# EAGLE design 14A-006 (EAGLE 9.6.2)
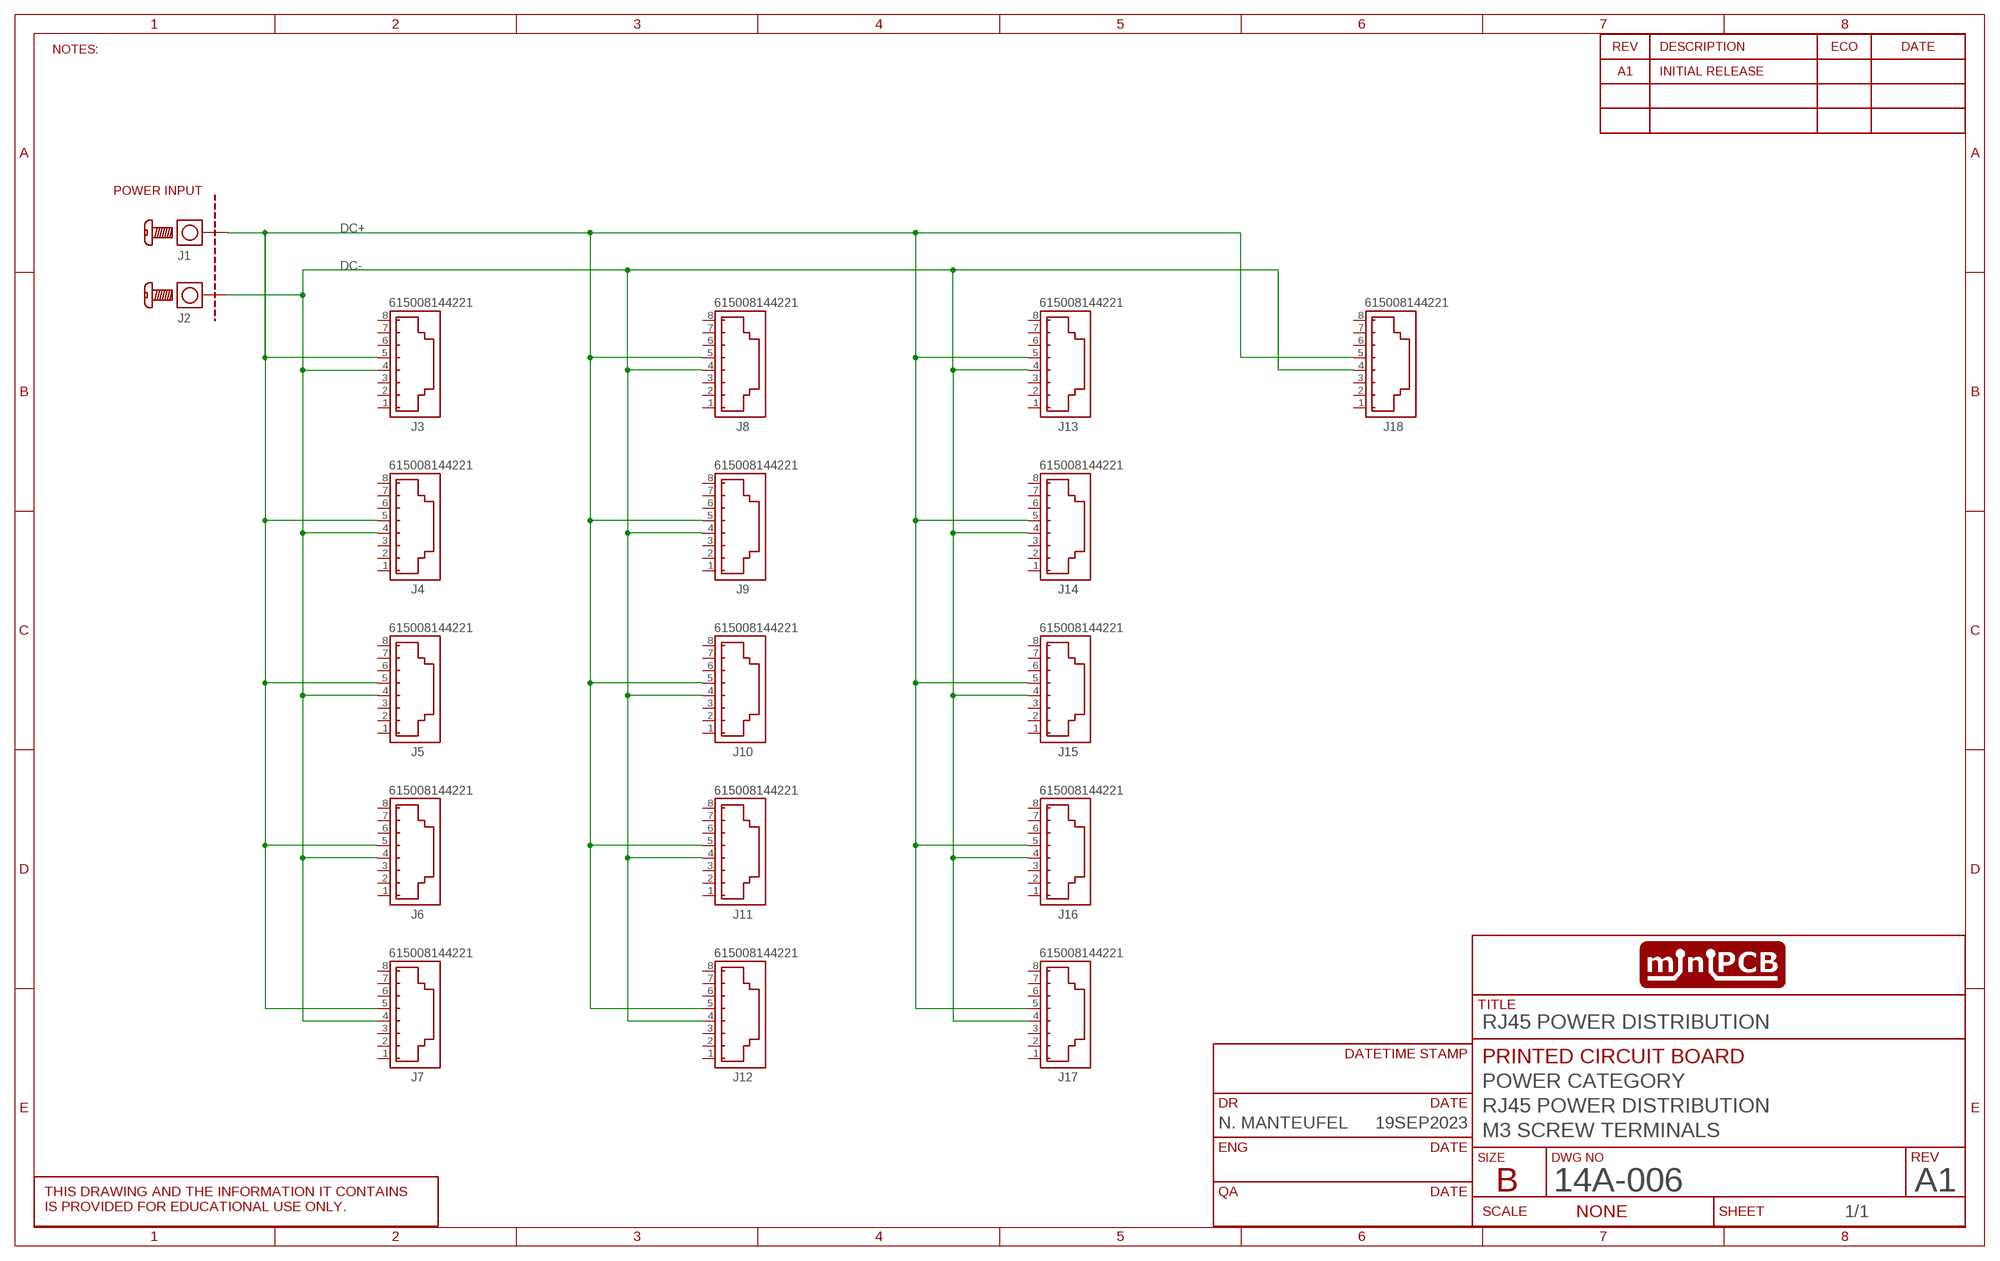
[diagram p0: schematic, sheet 1]
SHEET1 (SCHEMATIC): CIRCUIT_CATEGORY: POWER CATEGORY; CIRCUIT_NAME: RJ45 POWER DISTRIBUTION; CIRCUIT_VARIANT: M3 SCREW TERMINALS; DR: N. MANTEUFEL; DR_DATE: 19SEP2023; PCB_PCBA: PRINTED CIRCUIT BOARD; REVA: A1; REVISION: A1; TITLE: RJ45 POWER DISTRIBUTION

## Parts
-  POWER INPUT  MINIPCB_0PDOCK_50X100  [MINIPCB_DOCK_50X100]
J1  SCREW-TERMINAL  [SCREW-TERMINAL-M3]
J2  SCREW-TERMINAL  [SCREW-TERMINAL-M3]
J3  615008144221  [615008144221]
J4  615008144221  [615008144221]
J5  615008144221  [615008144221]
J6  615008144221  [615008144221]
J7  615008144221  [615008144221]
J8  615008144221  [615008144221]
J9  615008144221  [615008144221]
J10  615008144221  [615008144221]
J11  615008144221  [615008144221]
J12  615008144221  [615008144221]
J13  615008144221  [615008144221]
J14  615008144221  [615008144221]
J15  615008144221  [615008144221]
J16  615008144221  [615008144221]
J17  615008144221  [615008144221]
J18  615008144221  [615008144221]

## Nets
DC+: J1.1 J1.2 J1.3 J1.4 J3.5 J4.5 J5.5 J6.5 J7.5 J8.5 J9.5 J10.5 J11.5 J12.5 J13.5 J14.5 J15.5 J16.5 J17.5 J18.5
DC-: J2.1 J2.2 J2.3 J2.4 J3.4 J4.4 J5.4 J6.4 J7.4 J8.4 J9.4 J10.4 J11.4 J12.4 J13.4 J14.4 J15.4 J16.4 J17.4 J18.4
Unconnected: J3.1 J3.2 J3.3 J3.6 J3.7 J3.8 J4.1 J4.2 J4.3 J4.6 J4.7 J4.8 J5.1 J5.2 J5.3 J5.6 J5.7 J5.8 J6.1 J6.2 J6.3 J6.6 J6.7 J6.8 J7.1 J7.2 J7.3 J7.6 J7.7 J7.8 J8.1 J8.2 J8.3 J8.6 J8.7 J8.8 J9.1 J9.2 J9.3 J9.6 J9.7 J9.8 J10.1 J10.2 J10.3 J10.6 J10.7 J10.8 J11.1 J11.2 J11.3 J11.6 J11.7 J11.8 J12.1 J12.2 J12.3 J12.6 J12.7 J12.8 J13.1 J13.2 J13.3 J13.6 J13.7 J13.8 J14.1 J14.2 J14.3 J14.6 J14.7 J14.8 J15.1 J15.2 J15.3 J15.6 J15.7 J15.8 J16.1 J16.2 J16.3 J16.6 J16.7 J16.8 J17.1 J17.2 J17.3 J17.6 J17.7 J17.8 J18.1 J18.2 J18.3 J18.6 J18.7 J18.8

## Notes on the sheet
- NOTES:

## Library data of the parts
- = minipcb:MINIPCB_0P; NAME1: RJ45 POWER DISTRIBUTION; PART_NUMBER: 14A-006; REVISION: A1
J1 J2 = minipcb:SCREW-TERMINAL; REVISION: A1
J3-J18 = SIG_CONNECTORS:615008144221: WR-MJ Modular Jack Vertical Plastic 8P8C w. Ears Kind Properties Quality Class:500 Mating cycles General Information Operating Temperature:-40 up to +85 °C Compliance:RoHS Electrical Properties IR 1:1.5 A Working Voltage:120V (AC) Withstanding Voltage:1000V (AC) Contact Resistance:20mΩ RISO:500 MΩ Material Properties Insulator MateriaL:PBT Insulator Flammability Rating:UL94 V-0 Color:Black Contact Material Copper Alloy Contact Plating: Gold Contact Type:Stamped Packaging Properties Packaging:Tray <https://www.we-online.com/catalog/media/o33134v209%20Family_WR-MJ_615008144221.jpg> Details see: https://www.we-online.com/catalog/en/MJ_VERTICAL_PLASTIC_8P8C_W_EARS/ Updated by Ella Wu 2020-06-30 2020(C) Würth Elektronik; DATASHEET-URL: https://www.we-online.com/redexpert/spec/615008144221?ae; MFG1: WURTH ELEKTRONIK; MFG1_PN: 61500814221; MOUNT: THT; PART-NUMBER: 615008144221; TYPE: Vertical; XPXC: 8P8C

## Board
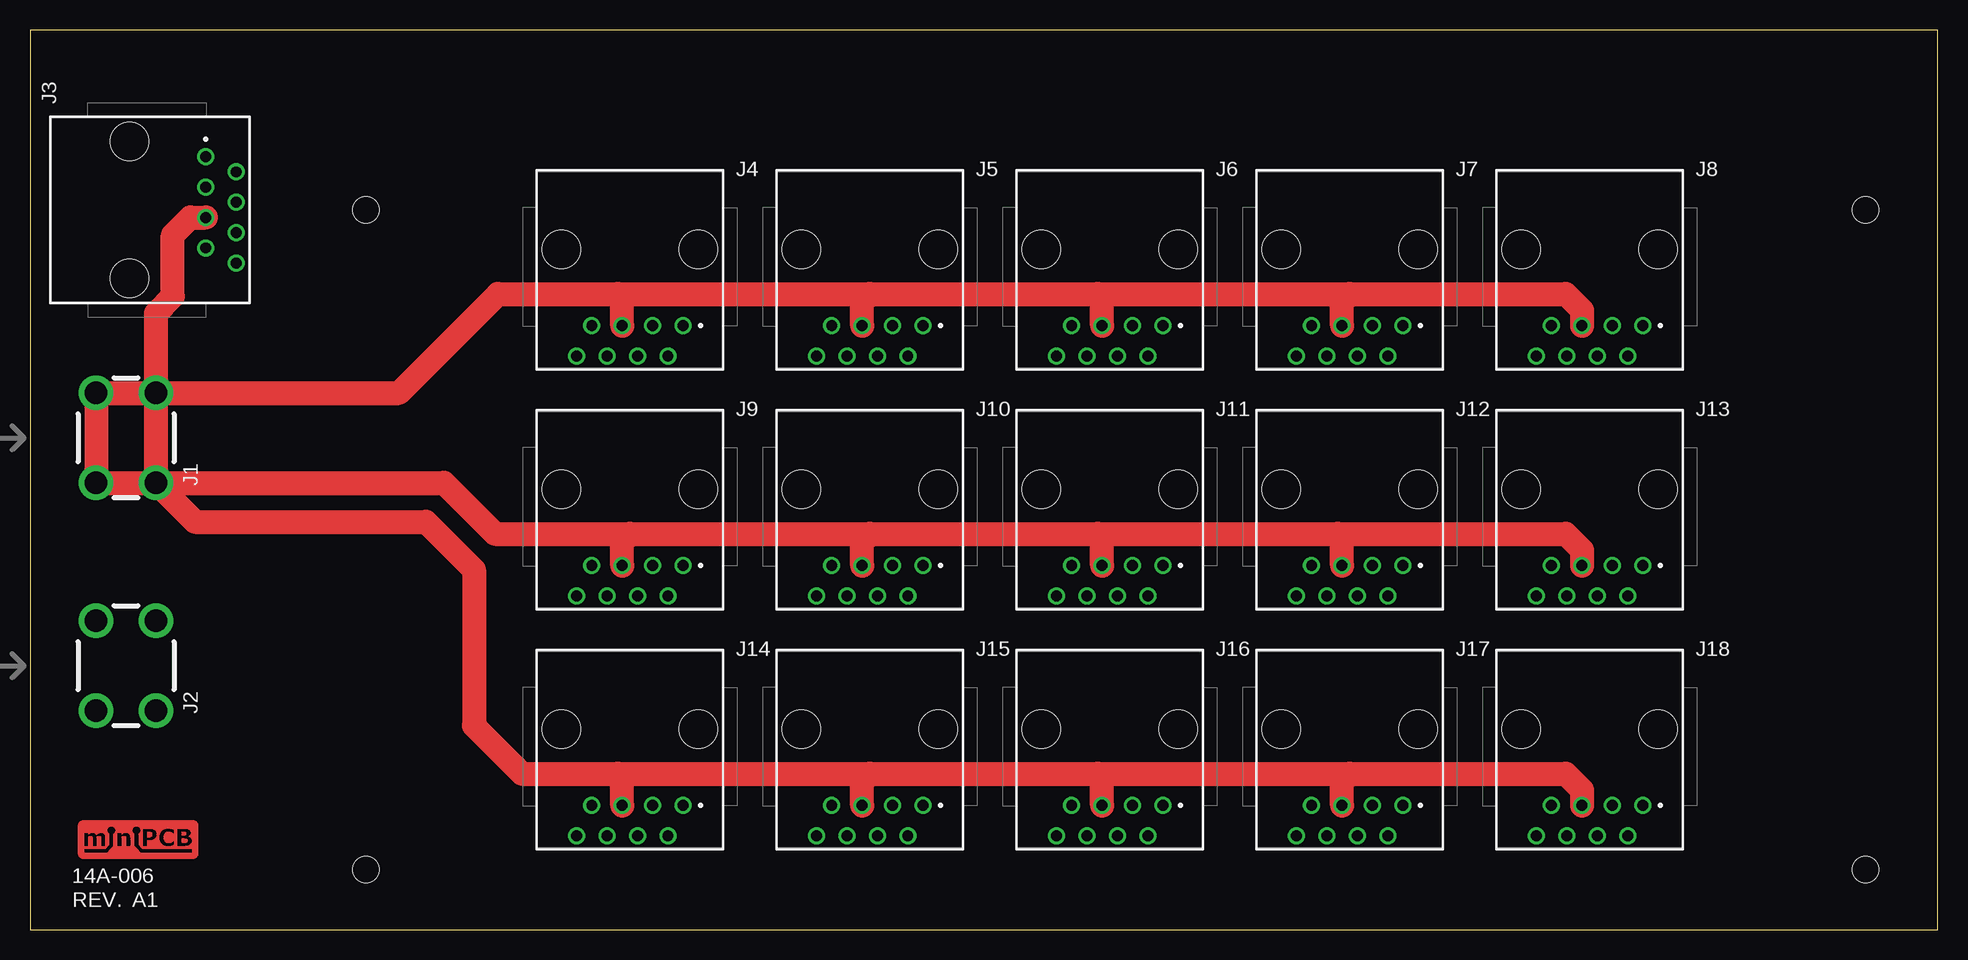
[diagram p1: board, top side]
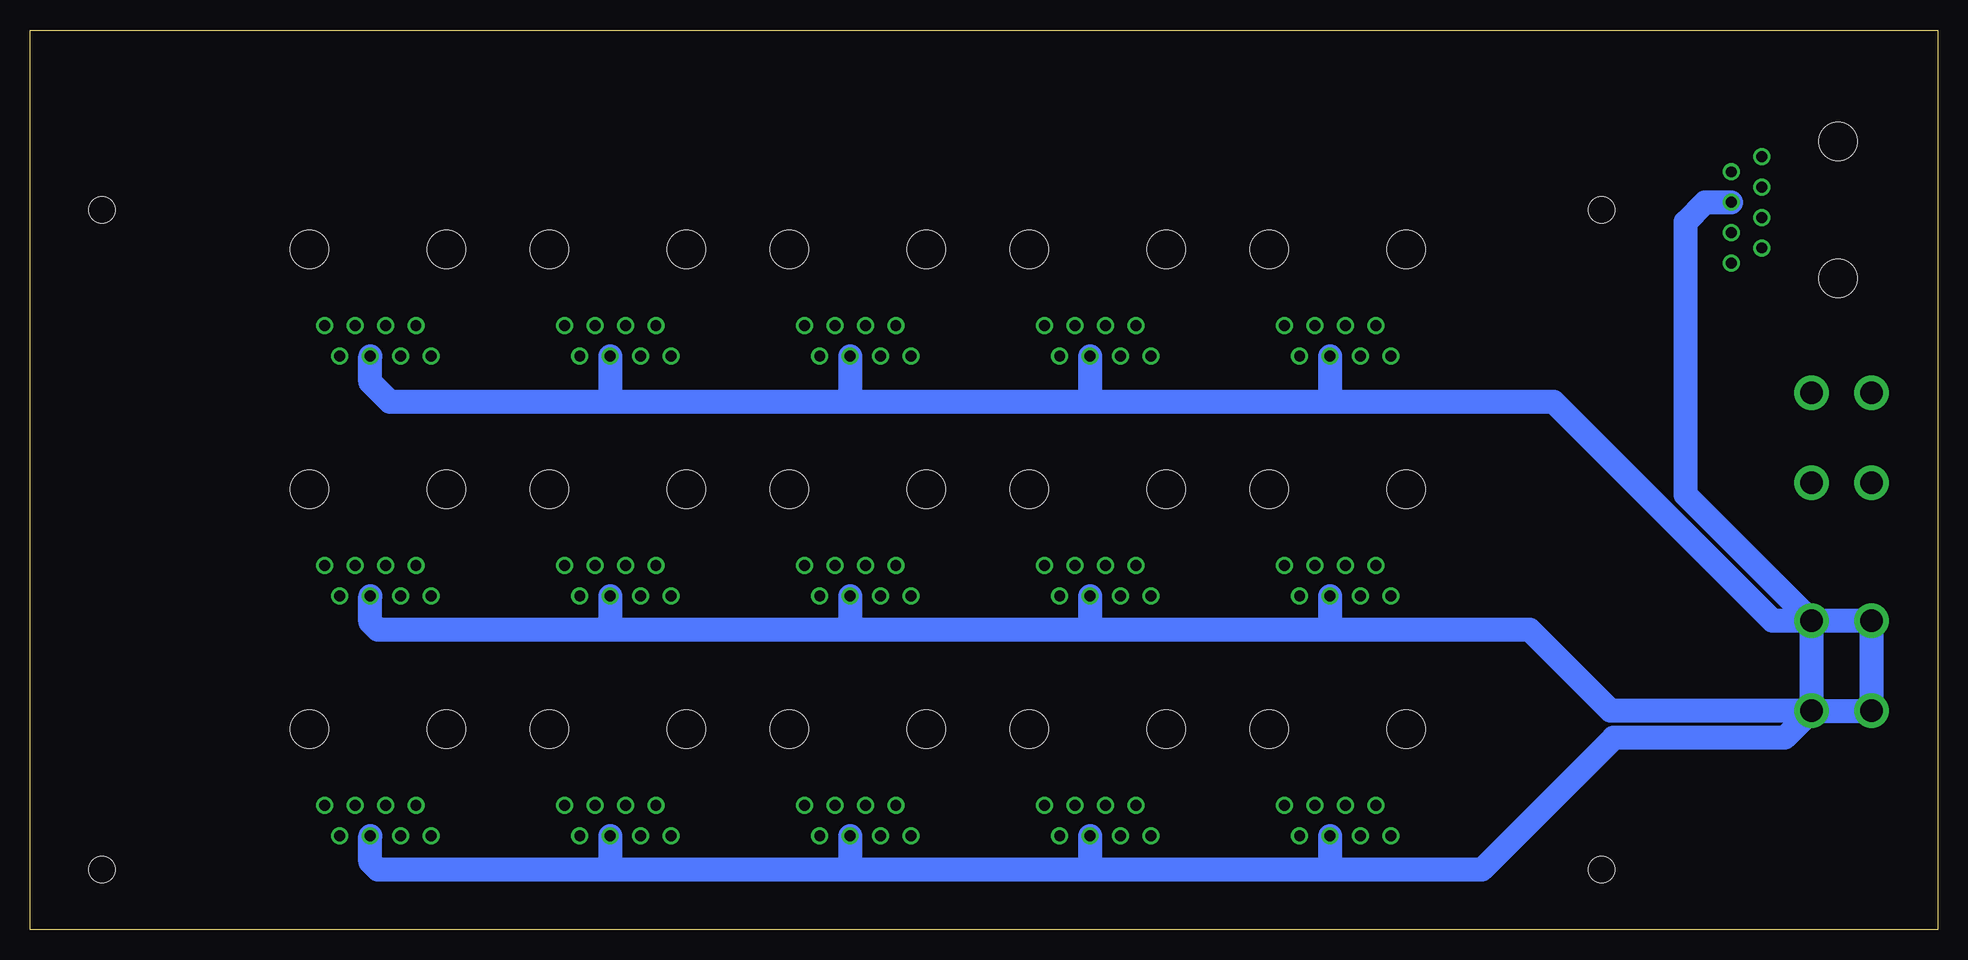
[diagram p2: board, bottom side, seen from below]

Size 159 x 75 mm. Coordinates in mm from the lower left corner, seen from the top.
Outline: 0,0 159,0 159,75 0,75 0,0
Copper layers (1*16): Top 0.035mm / dielectric 1.5mm / Bottom 0.035mm
Design rules "default": minimum track width 6mil, minimum drill 0.35mm, track to track 6mil, track to pad 6mil, pad to pad 6mil, via to via 6mil, smd to smd 6mil, copper to edge 40mil, drill to drill 6mil, minimum pad ring 10mil, minimum via ring 8mil, stop-mask expansion 4mil, vias tented up to drill 0mil, thermal gap 10mil

### Footprints (pad centres in the part's own frame; a part is rotated, then mirrored left to right if it is on the bottom)
MINIPCB_DOCK_50X100 = hole 2.2: 28,5; 153,5; 28,60; 153,60
SCREW-TERMINAL-M3 = drill 1.9: 1 -2.5,3.75; 2 2.5,3.75; 3 -2.5,-3.75; 4 2.5,-3.75
615008144221 = drill 0.9: 1 4.445,-4.65; 2 3.175,-7.19; 3 1.905,-4.65; 4 0.635,-7.19; 5 -0.635,-4.65; 6 -1.905,-7.19; 7 -3.175,-4.65; 8 -4.445,-7.19 | hole 3.17: 5.715,1.7; -5.715,1.7

### Placement (x,y rotation side)
-  0,0 0 top
J1  8,41 0 top
J2  8,22 0 top
J3  10,60 90 top
J4  50,55 0 top
J5  70,55 0 top
J6  90,55 0 top
J7  110,55 0 top
J8  130,55 0 top
J9  50,35 0 top
J10  70,35 0 top
J11  90,35 0 top
J12  110,35 0 top
J13  130,35 0 top
J14  50,15 0 top
J15  70,15 0 top
J16  90,15 0 top
J17  110,15 0 top
J18  130,15 0 top

### Tracks (layer width: path | path; a pad name or v marks a point on that pad's centre or on a via)
DC+
  Top 2: J1.4 J1.3 J1.1 J1.2 | J1.4 J1.2 | J1.2 10.5,51.39 11.9,52.79 11.9,57.9 13.37,59.37 J3.5 | J1.4 34.5,37.25 38.75,33 50,33 | J13.5 129.37,31.64 128,33 109,33 | 50,33 70,33 | 70,33 89,33 | 89,33 109,33 | J12.5 109.36,32.63 109,33 | J11.5 89.36,32.63 89,33 | J10.5 69.36,32.37 70,33 | J9.5 49.37,32.37 50,33 | J1.4 13.75,34 33,34 37,30 37,17 41,13 49,13 | 49,13 70,13 | 70,13 89,13 | 89,13 110,13 | 110,13 128,13 129.37,11.63 J18.5 | J17.5 109.36,12.37 110,13 | J16.5 89.36,12.63 89,13 | J15.5 69.36,12.37 70,13 | J14.5 49.37,12.63 49,13 | J1.2 30.75,44.75 39,53 49,53 | 49,53 70,53 | 70,53 89,53 | 89,53 110,53 | 110,53 128,53 129.37,51.63 J8.5 | J7.5 109.36,52.37 110,53 | J6.5 89.36,52.63 89,53 | J5.5 69.36,52.37 70,53 | J4.5 49.37,52.63 49,53
DC-
  Bottom 2: J2.2 21,36.25 21,59 19.36,60.63 J3.4 | J2.2 13.75,25.75 32,44 50,44 | J8.4 130.63,45.63 129,44 110,44 | 50,44 70,44 | 70,44 91,44 | 91,44 110,44 | J7.4 110.64,44.63 110,44 | J6.4 90.64,44.37 91,44 | J5.4 70.64,44.63 70,44 | J4.4 50.63,44.63 50,44 | J2.2 J2.1 J2.3 J2.4 | J2.4 J2.2 | J2.4 27.25,18.25 34,25 51,25 | 51,25 70,25 | 70,25 91,25 | 91,25 111,25 | 111,25 130,25 130.63,25.64 J13.4 | J12.4 110.64,25.36 111,25 | J11.4 90.64,25.36 91,25 | J10.4 70.64,25.64 70,25 | J9.4 50.63,25.36 51,25 | J2.4 12.75,16 27,16 38,5 51,5 | J18.4 130.63,5.63 130,5 111,5 | 51,5 71,5 | 71,5 91,5 | 91,5 111,5 | J17.4 110.64,5.37 111,5 | J16.4 90.64,5.37 91,5 | J15.4 70.64,5.37 71,5 | J14.4 50.63,5.37 51,5